# EAGLE design osc devre (EAGLE 9.6.2)
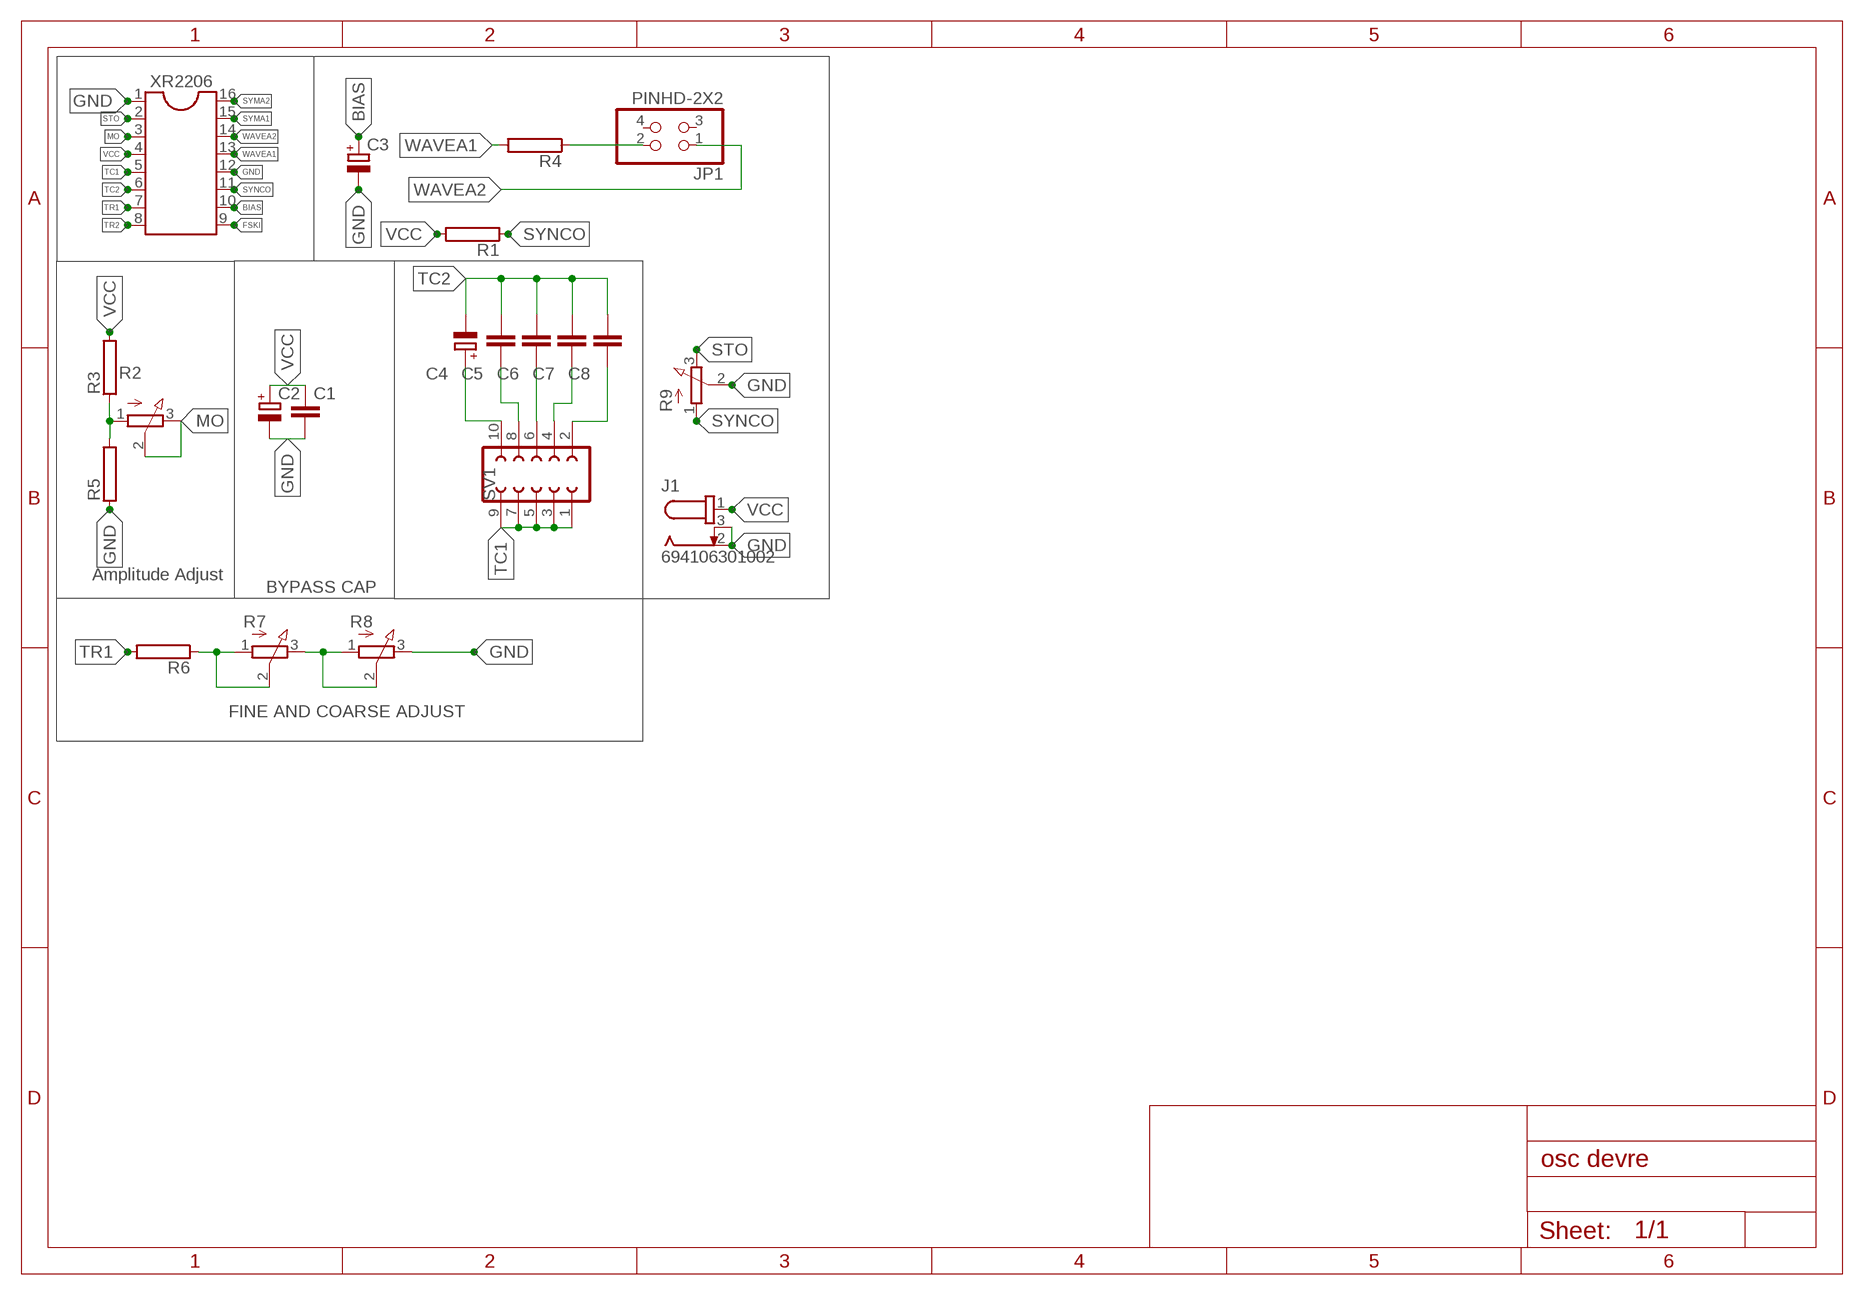
[diagram p0: schematic, sheet 1]

## Parts
C1  C5/3  [C5B3]
C2  C-POL_RADIAL-11MM-DIA  [CAPPRD508W65D1000H1100B]
C3  C-POL_RADIAL-11MM-DIA  [CAPPRD508W65D1000H1100B]
C4  CPOL-EUE2.5-5  [E2,5-5]
C5  C5/3  [C5B3]
C6  C5/3  [C5B3]
C7  C5/3  [C5B3]
C8  C5/3  [C5B3]
J1  694106301002  [694106301002]
JP1  PINHD-2X2  [2X02]
R1  RCA0001  [CA0001]
R2  3RP/1610N  [3RP/1610N]
R3  RCA0001  [CA0001]
R4  RCA0001  [CA0001]
R5  RCA0001  [CA0001]
R6  RCA0001  [CA0001]
R7  3RP/1610N  [3RP/1610N]
R8  3RP/1610N  [3RP/1610N]
R9  3RP/1610N  [3RP/1610N]
SV1  FE05-2  [FE05-2]
XR2206  DIL16  [DIL16]

## Nets
BIAS: C3.1(+) XR2206.10
FSKI: XR2206.9
GND: C1.2 C2.2(-) C3.2(-) J1.2 J1.3 R5.1 R8.3(E) R9.2(S) XR2206.1 XR2206.12
MO: R2.2(S) R2.3(E) XR2206.3
N$1: R6.1 R7.1(A) R7.2(S)
N$2: JP1.2 R4.1
N$3: R7.3(E) R8.1(A) R8.2(S)
N$4: C8.1 SV1.2
N$5: R2.1(A) R3.1 R5.2
N$6: C7.1 SV1.4
N$7: C6.1 SV1.6
N$8: C5.1 SV1.8
N$9: C4.+ SV1.10
STO: R9.3(E) XR2206.2
SYMA1: XR2206.15
SYMA2: XR2206.16
SYNCO: R1.1 R9.1(A) XR2206.11
TC1: SV1.1 SV1.3 SV1.5 SV1.7 SV1.9 XR2206.5
TC2: C4.- C5.2 C6.2 C7.2 C8.2 XR2206.6
TR1: R6.2 XR2206.7
TR2: XR2206.8
VCC: C1.1 C2.1(+) J1.1 R1.2 R3.2 XR2206.4
WAVEA1: R4.2 XR2206.13
WAVEA2: JP1.1 XR2206.14
Unconnected: JP1.3 JP1.4

## Notes on the sheet
- Amplitude Adjust | BYPASS CAP
- FINE AND COARSE ADJUST

## Library data of the parts
C1 C5-C8 = capacitor-wima:C: CAPACITOR naming: grid - package width
C2 C3 = Capacitor:C-POL: Capacitor Polarised - Generic; CATEGORY: Capacitor
C4 = rcl:CPOL-EU: POLARIZED CAPACITOR, European symbol; SPICEPREFIX: C
J1 = DC Power Jacks:694106301002: CONN PWR JACK 2.1X5.5MM SOLDER Manufacturer's datasheet <https://katalog.we-online.de/em/datasheet/6941xx301002.pdf>; CREATED_BY: PCBLayout.com; DIGIKEY_PART_NUMBER: 732-5930-ND; MANUFACTURER: Wurth Electronics Inc.; MPN: 694106301002
JP1 = Connector:PINHD-2X2: PIN HEADER; CATEGORY: CONNECTOR; SUB-CATEGORY: PIN-HEADER
R1 R3-R6 = resistor-power:R: Power Resitor; OC_FARNELL: unknown; OC_NEWARK: unknown
R2 R7-R9 = pot:3RP/1610N: 16mm Potentiometer one level Source: http://www.alphapotentiometers.net/html/16mm_pot_2.html
SV1 = con-lsta:FE05-2: FEMALE HEADER; OC_FARNELL: unknown; OC_NEWARK: unknown
XR2206 = ic-package:DIL16: Dual In Line / Socket

## Net classes
0 default: clearance 0.205 mm

## Board
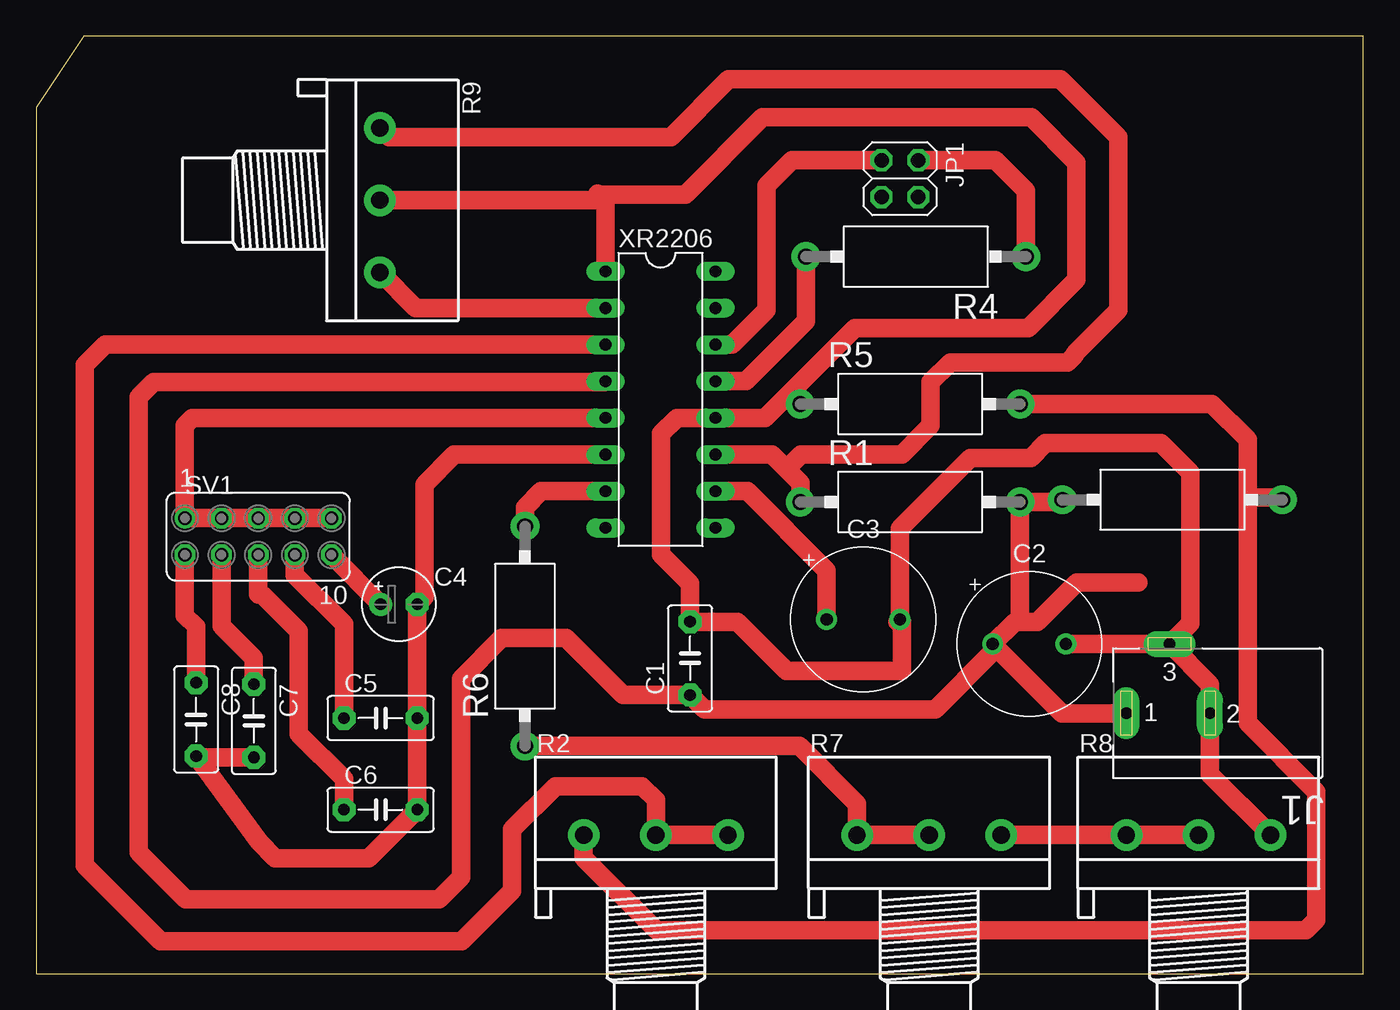
[diagram p1: board, top side]

Size 92 x 65 mm. Coordinates in mm from the lower left corner, seen from the top.
Outline: 0,0 92,0 92,65 3.31,65 0,60.05 0,0
Copper layers (1*16): Top 0.035mm / dielectric 1.5mm / Bottom 0.035mm
Design rules "default": minimum track width 6mil, minimum drill 0.35mm, track to track 6mil, track to pad 6mil, pad to pad 6mil, via to via 6mil, smd to smd 6mil, copper to edge 40mil, drill to drill 6mil, minimum pad ring 10mil, minimum via ring 8mil, stop-mask expansion 4mil, vias tented up to drill 0mil, thermal gap 10mil

### Footprints (pad centres in the part's own frame; a part is rotated, then mirrored left to right if it is on the bottom)
C5B3 = drill 0.813 pad 1.6 octagon: 1 -2.54,0; 2 2.54,0
CAPPRD508W65D1000H1100B = drill 0.85 pad 1.45: 1 -2.54,0; 2 2.54,0
E2,5-5 = drill 0.813 pad 1.6: + -1.27,0 | drill 0.813 pad 1.6 octagon: - 1.27,0
694106301002 = drill 0.8 pad 1.8 long: 1 13.6,0; 2 7.8,0; 3 10.6,-4.8
2X02 = drill 1.016 octagon: 1 -1.27,-1.27; 2 -1.27,1.27; 3 1.27,-1.27; 4 1.27,1.27
CA0001 = drill 1.1 pad 2: 1 -7.62,0; 2 7.62,0
3RP/1610N = drill 1.2 pad 2.184: 1 -5,0; 2 0,0; 3 5,0
FE05-2 = drill 0.914: 1 -5.08,1.27 | drill 0.914 octagon: 2 -5.08,-1.27; 3 -2.54,1.27; 4 -2.54,-1.27; 5 0,1.27; 6 0,-1.27; 7 2.54,1.27; 8 2.54,-1.27; 9 5.08,1.27; 10 5.08,-1.27
DIL16 = drill 0.813 long: 1 -8.89,-3.81; 2 -6.35,-3.81; 3 -3.81,-3.81; 4 -1.27,-3.81; 5 1.27,-3.81; 6 3.81,-3.81; 7 6.35,-3.81; 8 8.89,-3.81; 9 8.89,3.81; 10 6.35,3.81; 11 3.81,3.81; 12 1.27,3.81; 13 -1.27,3.81; 14 -3.81,3.81; 15 -6.35,3.81; 16 -8.89,3.81

### Placement (x,y rotation side)
C1  45.33,21.86 90 top
C2  68.84,22.86 0 top
C3  57.33,24.56 0 top
C4  25.15,25.61 0 top
C5  23.88,17.72 0 top
C6  23.88,11.37 0 top
C7  15.09,17.53 270 top
C8  11.09,17.63 270 top
J1  89.17,18.06 180 top
JP1  59.87,55.12 270 top
R1  60.58,32.7 0 top
R2  42.96,9.62 0 top
R3  78.77,32.85 180 top
R4  60.98,49.71 180 top
R5  60.58,39.5 0 top
R6  33.88,23.4 90 top
R7  61.9,9.62 0 top
R8  80.57,9.62 0 top
R9  23.84,53.62 270 top
SV1  15.4,30.31 0 top
XR2206  43.28,39.8 270 top

### Tracks (layer width: path | path; a pad name or v marks a point on that pad's centre or on a via)
BIAS
  Top 1.27: XR2206.10 49.3,33.45 54.79,27.96 C3.1
GND
  Top 1.27: 49.53,38.53 XR2206.12 | R5.1 52.23,40.23 | 52.23,40.23 56.76,44.76 68.76,44.76 72.11,48.11 72.11,56.24 68.98,59.37 50.36,59.37 45,54 39,54 | 59.71,24.4 C3.2 | XR2206.1 39.47,53.53 39.38,53.62 | 39.38,53.62 39,54 | 39,54 38.93,54.07 | XR2206.12 50.53,38.53 52.23,40.23 | C3.2 60,24.43 60,21 52,21 48.6,24.4 C1.2 45.33,27.05 43.32,29.06 43.32,37.44 44.41,38.53 XR2206.12 | C3.2 59.87,30.87 64.77,35.77 68.95,35.77 69.96,36.78 77.97,36.78 80,34.75 80,24.3 J1.3 | J1.3 C2.2 | J1.3 81.37,20.06 J1.2 81.37,13.82 R8.3 | 39.38,53.62 R9.2
MO
  Top 1.27: R2.3 R2.2 42.96,12.04 42,13 36,13 33,10 33,5.76 29.49,2.25 8.65,2.25 3.38,7.52 3.38,42.19 4.8,43.61 XR2206.3
N$1
  Top 1.27: R6.1 52.9,15.78 56.9,11.78 R7.1 R7.2
N$2
  Top 1.27: JP1.2 66.48,56.39 68.6,54.27 R4.1
N$3
  Top 1.27: R7.3 R8.1 R8.2
N$4
  Top 1.27: C8.1 11.09,24.08 10.31,24.85 SV1.2
N$5
  Top 1.27: R2.1 37.96,8.04 43,3 88,3 88.75,3.75 88.75,12.6 83.97,17.38 83.97,33 | R5.2 81.5,39.5 83.97,37.03 83.97,33 | 83.97,33 86.24,33 R3.1
N$6
  Top 1.27: C7.1 15.09,21.88 12.85,24.12 SV1.4
N$7
  Top 1.27: C6.1 21.34,13.5 18.2,16.64 18.2,23.78 15.68,26.29 15.41,26.29 15.4,26.3 SV1.6
N$8
  Top 1.27: C5.1 21.34,24.24 17.94,27.65 SV1.8
N$9
  Top 1.27: C4.+ 20.48,29.02 SV1.10
STO
  Top 1.27: XR2206.2 26.31,46.15 R9.3
SYNCO
  Top 1.27: R1.1 52.97,34.03 52,35 | XR2206.11 51.01,35.99 52,35 | 52,35 53,36 60,36 62,38 62,41 63.37,42.37 71.49,42.37 72,42.88 72,43 75,46 75,58 71,62 48,62 44,58 24.46,58 R9.1
TC1
  Top 1.27: XR2206.5 10.83,38.53 10.31,38.02 SV1.1 SV1.3 SV1.5 SV1.7 SV1.9
TC2
  Top 1.27: XR2206.6 28.99,35.99 26.93,33.93 26.93,26.12 C4.- C5.2 C6.2 23.05,8 16.58,8 15.45,9.13 C8.2 11.19,14.99 C7.2
TR1
  Top 1.27: R6.2 33.88,32.32 35.01,33.45 XR2206.7
VCC
  Top 1.27: C2.1 67.84,24.4 68.2,24.4 | R1.2 68.2,24.4 | XR2206.4 39.4,41 8.14,41 7.11,39.97 7.11,8.43 10.38,5.16 27.93,5.16 29.45,6.68 29.45,20.45 32.27,23.27 36.73,23.27 40.68,19.32 C1.1 46.33,18.32 62.32,18.32 66.3,22.3 C2.1 | R1.2 68.03,32.7 | 68.2,32.16 R1.2 | 68.2,24.4 69.4,24.4 72.14,27.14 76.4,27.14 | R3.2 71,32.7 R1.2 | J1.1 71.1,18.06 C2.1
WAVEA1
  Top 1.27: XR2206.13 49.2,41.07 53.36,45.23 R4.2
WAVEA2
  Top 1.27: XR2206.14 48.23,43.61 50.64,46.02 50.64,54.63 52.39,56.39 JP1.1